# Altium schematic sheet LEDs.SchDoc
size A4
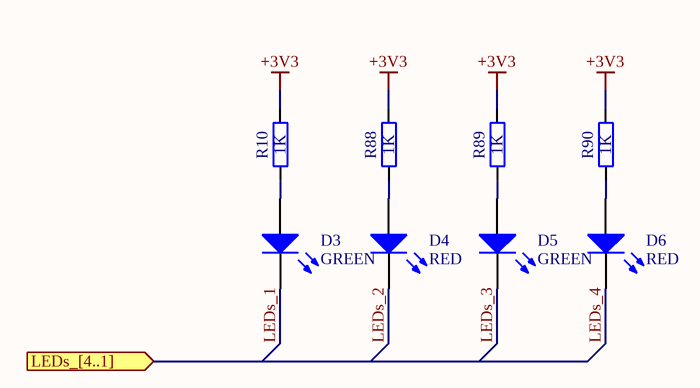
[diagram p0: LEDs.SchDoc]

## Parts
D3  GREEN  [LED_0603_APT1608]
D4  RED  [LED_0603_APT1608]
D5  GREEN  [LED_0603_APT1608]
D6  RED  [LED_0603_APT1608]
R10  1K  [GEN_R_0402]
R88  1K  [GEN_R_0402]
R89  1K  [GEN_R_0402]
R90  1K  [GEN_R_0402]

## Ports
LEDs_[4..1] (in)

## Nets
+3V3: R10.2 R88.2 R89.2 R90.2
LEDs_1: D3.1(K)
LEDs_2: D4.1(K)
LEDs_3: D5.1(K)
LEDs_4: D6.1(K)
NetD3_2: D3.2(A) R10.1
NetD4_2: D4.2(A) R88.1
NetD5_2: D5.2(A) R89.1
NetD6_2: D6.2(A) R90.1

## Library data of the parts
D3 D5 = LED GREEN 0603 APT1608: Supplier 1: Digi-Key; Supplier Part Number 1: 754-1934-1-ND
D4 D6 = LED RED 0603 APT1608: Supplier 1: Digi-Key; Supplier Part Number 1: 754-1930-1-ND
R10 R88-R90 = RES 1K OHM 1% 1/10W 0402: Tolerance: 1%; Power Rating: 0.1W; Package: 0402; Supplier 1: Digi-Key; Supplier Part Number 1: 311-1.00KLRCT-ND; Value: 1K